# EAGLE schematic NSL_Proxmark4 (EAGLE 5.11)

## Sheet 1 of 2
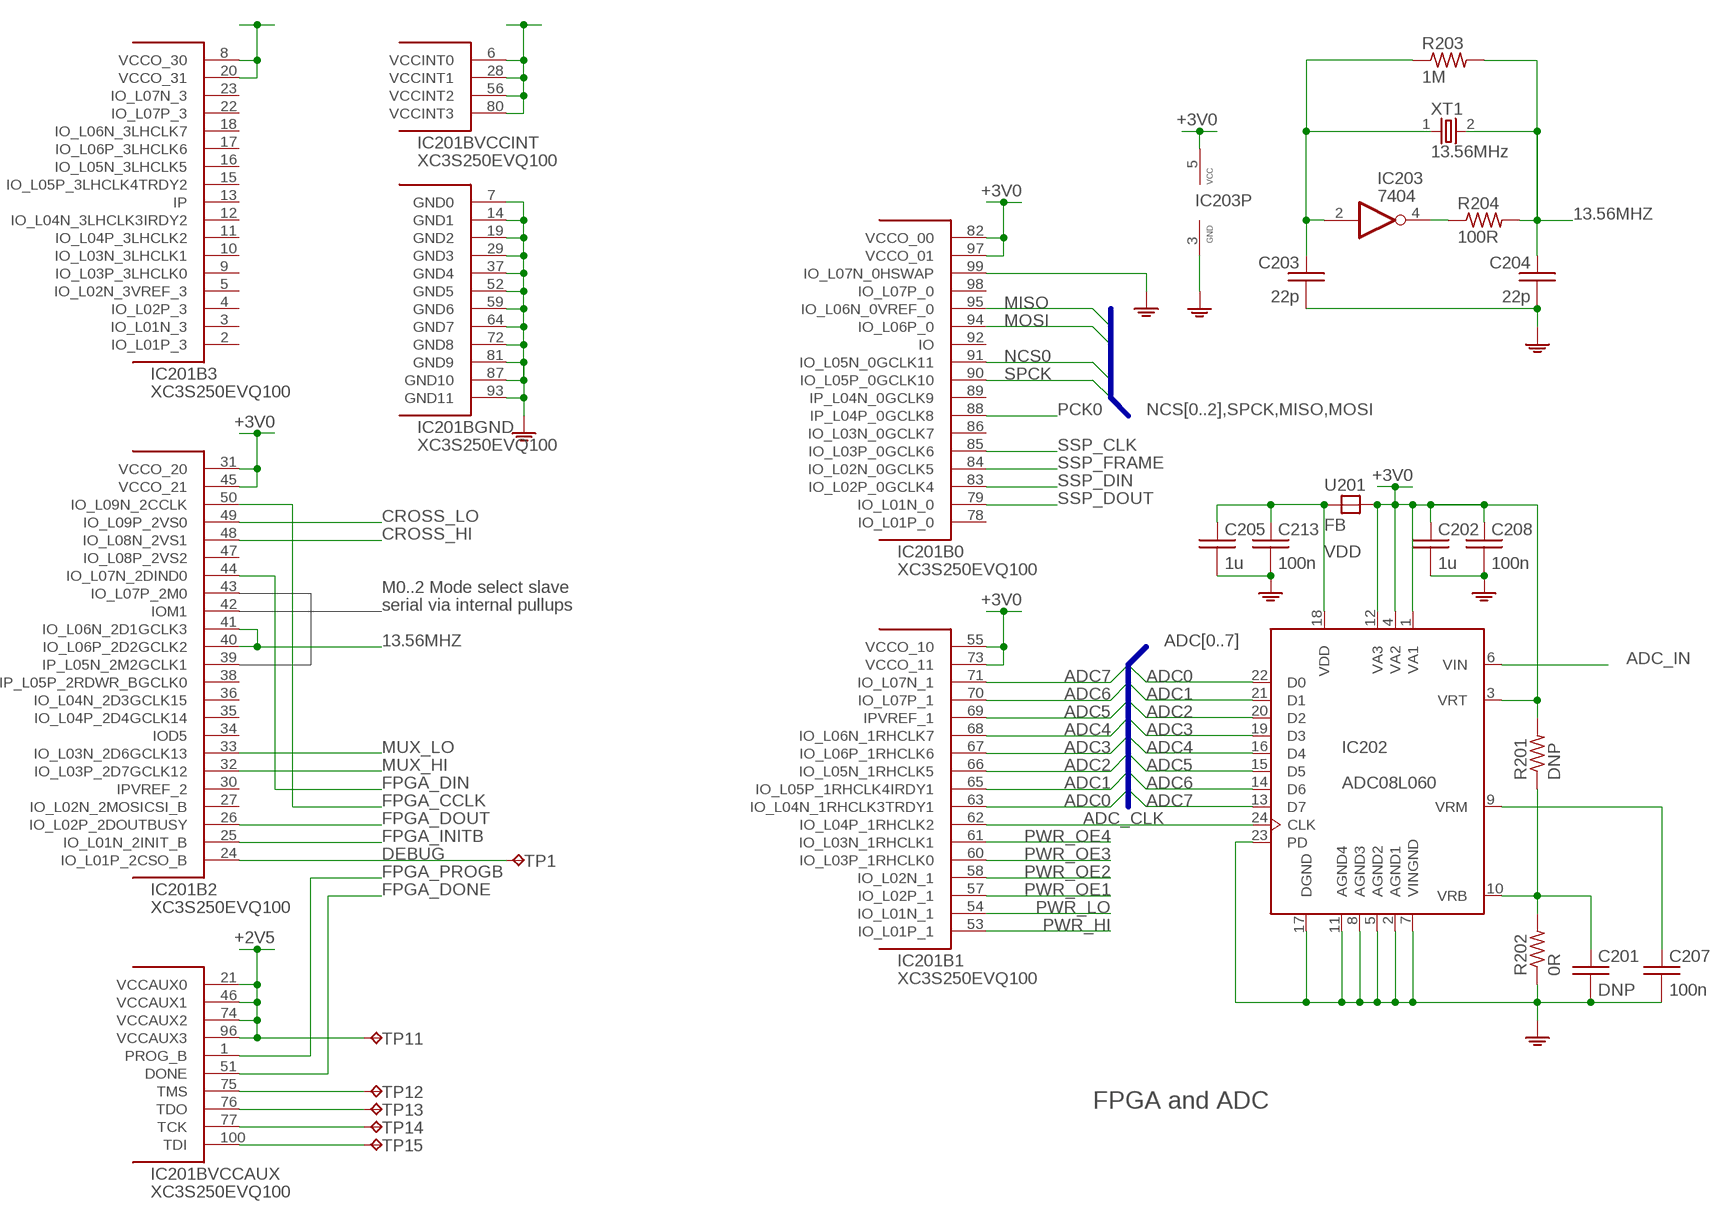
[diagram p0: schematic, sheet 1]

### Parts
C201  DNP  C-EU  [0603]
C202  1u  C-EU  [0603]
C203  22p  C-EU  [0603]
C204  22p  C-EU  [0603]
C205  1u  C-EU  [0603]
C207  100n  C-EU  [0603]
C208  100n  C-EU  [0603]
C213  100n  C-EU  [0603]
IC201  XC3S250EVQ100  [VQ100]
IC202  ADC08L060  ADC08060  [TSSOP24]
IC203  7404  [SOT-23-5]
R201  DNP  R-US  [0603]
R202  0R  R-US  [0603]
R203  1M  R-US  [0603]
R204  100R  R-US  [0603]
TP1  TPTP06SQ  [TP06SQ]
TP11  TPTP06SQ  [TP06SQ]
TP12  TPTP06SQ  [TP06SQ]
TP13  TPTP06SQ  [TP06SQ]
TP14  TPTP06SQ  [TP06SQ]
TP15  TPTP06SQ  [TP06SQ]
U201  FB  [0805]
XT1  13.56MHz  XTAL  [6035]

### Nets
13.56MHZ: C204.1 IC201.40(B2:IO_L06P_2D2GCLK2) IC201.41(B2:IO_L06N_2D1GCLK3) R203.2 R204.2 XT1.2(G$2)
+1V2: IC201.6(BVCCINT:VCCINT0) IC201.28(BVCCINT:VCCINT1) IC201.56(BVCCINT:VCCINT2) IC201.80(BVCCINT:VCCINT3)
+2V5: IC201.21(BVCCAUX:VCCAUX0) IC201.46(BVCCAUX:VCCAUX1) IC201.74(BVCCAUX:VCCAUX2) IC201.96(BVCCAUX:VCCAUX3) TP11.TP
+3V0: C202.1 C208.1 IC201.8(B3:VCCO_30) IC201.20(B3:VCCO_31) IC201.31(B2:VCCO_20) IC201.45(B2:VCCO_21) IC201.55(B1:VCCO_10) IC201.73(B1:VCCO_11) IC201.82(B0:VCCO_00) IC201.97(B0:VCCO_01) IC202.1(VA1) IC202.3(VRT) IC202.4(VA2) IC202.12(VA3) IC203.5(VCC) R201.2 U201.2(B) ; also sheet 2
ADC0: IC201.63(B1:IO_L04N_1RHCLK3TRDY1) IC202.22(D0)
ADC1: IC201.65(B1:IO_L05P_1RHCLK4IRDY1) IC202.21(D1)
ADC2: IC201.66(B1:IO_L05N_1RHCLK5) IC202.20(D2)
ADC3: IC201.67(B1:IO_L06P_1RHCLK6) IC202.19(D3)
ADC4: IC201.68(B1:IO_L06N_1RHCLK7) IC202.16(D4)
ADC5: IC201.69(B1:IPVREF_1) IC202.15(D5)
ADC6: IC201.70(B1:IO_L07P_1) IC202.14(D6)
ADC7: IC201.71(B1:IO_L07N_1) IC202.13(D7)
ADC_CLK: IC201.62(B1:IO_L04P_1RHCLK2) IC202.24(CLK)
ADC_IN: IC202.6(VIN) ; also sheet 2
CROSS_HI: IC201.48(B2:IO_L08N_2VS1) ; also sheet 2
CROSS_LO: IC201.49(B2:IO_L09P_2VS0) ; also sheet 2
DEBUG: IC201.24(B2:IO_L01P_2CSO_B) TP1.TP
FPGA_CCLK: IC201.50(B2:IO_L09N_2CCLK)
FPGA_DIN: IC201.44(B2:IO_L07N_2DIND0)
FPGA_DONE: IC201.51(BVCCAUX:DONE)
FPGA_DOUT: IC201.26(B2:IO_L02P_2DOUTBUSY)
FPGA_INITB: IC201.25(B2:IO_L01N_2INIT_B)
FPGA_PROGB: IC201.1(BVCCAUX:PROG_B)
FPGA_TCK: IC201.77(BVCCAUX:TCK) TP14.TP
FPGA_TDI: IC201.100(BVCCAUX:TDI) TP15.TP
FPGA_TDO: IC201.76(BVCCAUX:TDO) TP13.TP
FPGA_TMS: IC201.75(BVCCAUX:TMS) TP12.TP
GND: C201.2 C202.2 C203.2 C204.2 C205.2 C207.2 C208.2 C213.2 IC201.7(BGND:GND0) IC201.14(BGND:GND1) IC201.19(BGND:GND2) IC201.29(BGND:GND3) IC201.37(BGND:GND4) IC201.52(BGND:GND5) IC201.59(BGND:GND6) IC201.64(BGND:GND7) IC201.72(BGND:GND8) IC201.81(BGND:GND9) IC201.87(BGND:GND10) IC201.93(BGND:GND11) IC201.99(B0:IO_L07N_0HSWAP) IC202.2(AGND1) IC202.5(AGND2) IC202.7(VINGND) IC202.8(AGND3) IC202.11(AGND4) IC202.17(DGND) IC202.23(PD) IC203.3(GND) R202.1 ; supply symbol labelled AGND ; also sheet 2
MISO: IC201.95(B0:IO_L06N_0VREF_0)
MOSI: IC201.94(B0:IO_L06P_0)
MUX_HI: IC201.32(B2:IO_L03P_2D7GCLK12) ; also sheet 2
MUX_LO: IC201.33(B2:IO_L03N_2D6GCLK13) ; also sheet 2
N$1: C207.1 IC202.9(VRM)
N$3: IC203.4(O) R204.1
N$4: C203.1 IC203.2(I) R203.1 XT1.1(G$1)
N$9: C201.1 IC202.10(VRB) R201.1 R202.2
NCS0: IC201.91(B0:IO_L05N_0GCLK11)
PCK0: IC201.88(B0:IP_L04P_0GCLK8)
PWR_HI: IC201.53(B1:IO_L01P_1)
PWR_LO: IC201.54(B1:IO_L01N_1)
PWR_OE1: IC201.57(B1:IO_L02P_1)
PWR_OE2: IC201.58(B1:IO_L02N_1)
PWR_OE3: IC201.60(B1:IO_L03P_1RHCLK0)
PWR_OE4: IC201.61(B1:IO_L03N_1RHCLK1)
SPCK: IC201.90(B0:IO_L05P_0GCLK10)
SSP_CLK: IC201.85(B0:IO_L03P_0GCLK6)
SSP_DIN: IC201.83(B0:IO_L02P_0GCLK4)
SSP_DOUT: IC201.79(B0:IO_L01N_0)
SSP_FRAME: IC201.84(B0:IO_L02N_0GCLK5)
VDD: C205.1 C213.1 IC202.18(VDD) U201.1(A)
Unconnected: IC201.2(B3:IO_L01P_3) IC201.3(B3:IO_L01N_3) IC201.4(B3:IO_L02P_3) IC201.5(B3:IO_L02N_3VREF_3) IC201.9(B3:IO_L03P_3LHCLK0) IC201.10(B3:IO_L03N_3LHCLK1) IC201.11(B3:IO_L04P_3LHCLK2) IC201.12(B3:IO_L04N_3LHCLK3IRDY2) IC201.13(B3:IP) IC201.15(B3:IO_L05P_3LHCLK4TRDY2) IC201.16(B3:IO_L05N_3LHCLK5) IC201.17(B3:IO_L06P_3LHCLK6) IC201.18(B3:IO_L06N_3LHCLK7) IC201.22(B3:IO_L07P_3) IC201.23(B3:IO_L07N_3) IC201.27(B2:IO_L02N_2MOSICSI_B) IC201.30(B2:IPVREF_2) IC201.34(B2:IOD5) IC201.35(B2:IO_L04P_2D4GCLK14) IC201.36(B2:IO_L04N_2D3GCLK15) IC201.38(B2:IP_L05P_2RDWR_BGCLK0) IC201.39(B2:IP_L05N_2M2GCLK1) IC201.42(B2:IOM1) IC201.43(B2:IO_L07P_2M0) IC201.47(B2:IO_L08P_2VS2) IC201.78(B0:IO_L01P_0) IC201.86(B0:IO_L03N_0GCLK7) IC201.89(B0:IP_L04N_0GCLK9) IC201.92(B0:IO) IC201.98(B0:IO_L07P_0)

### Buses
NCS[0..2],SPCK,MISO,MOSI
ADC[0..7]

### Notes on the sheet
- M0..2 Mode select slave
- serial via internal pullups
- FPGA and ADC

## Sheet 2 of 2
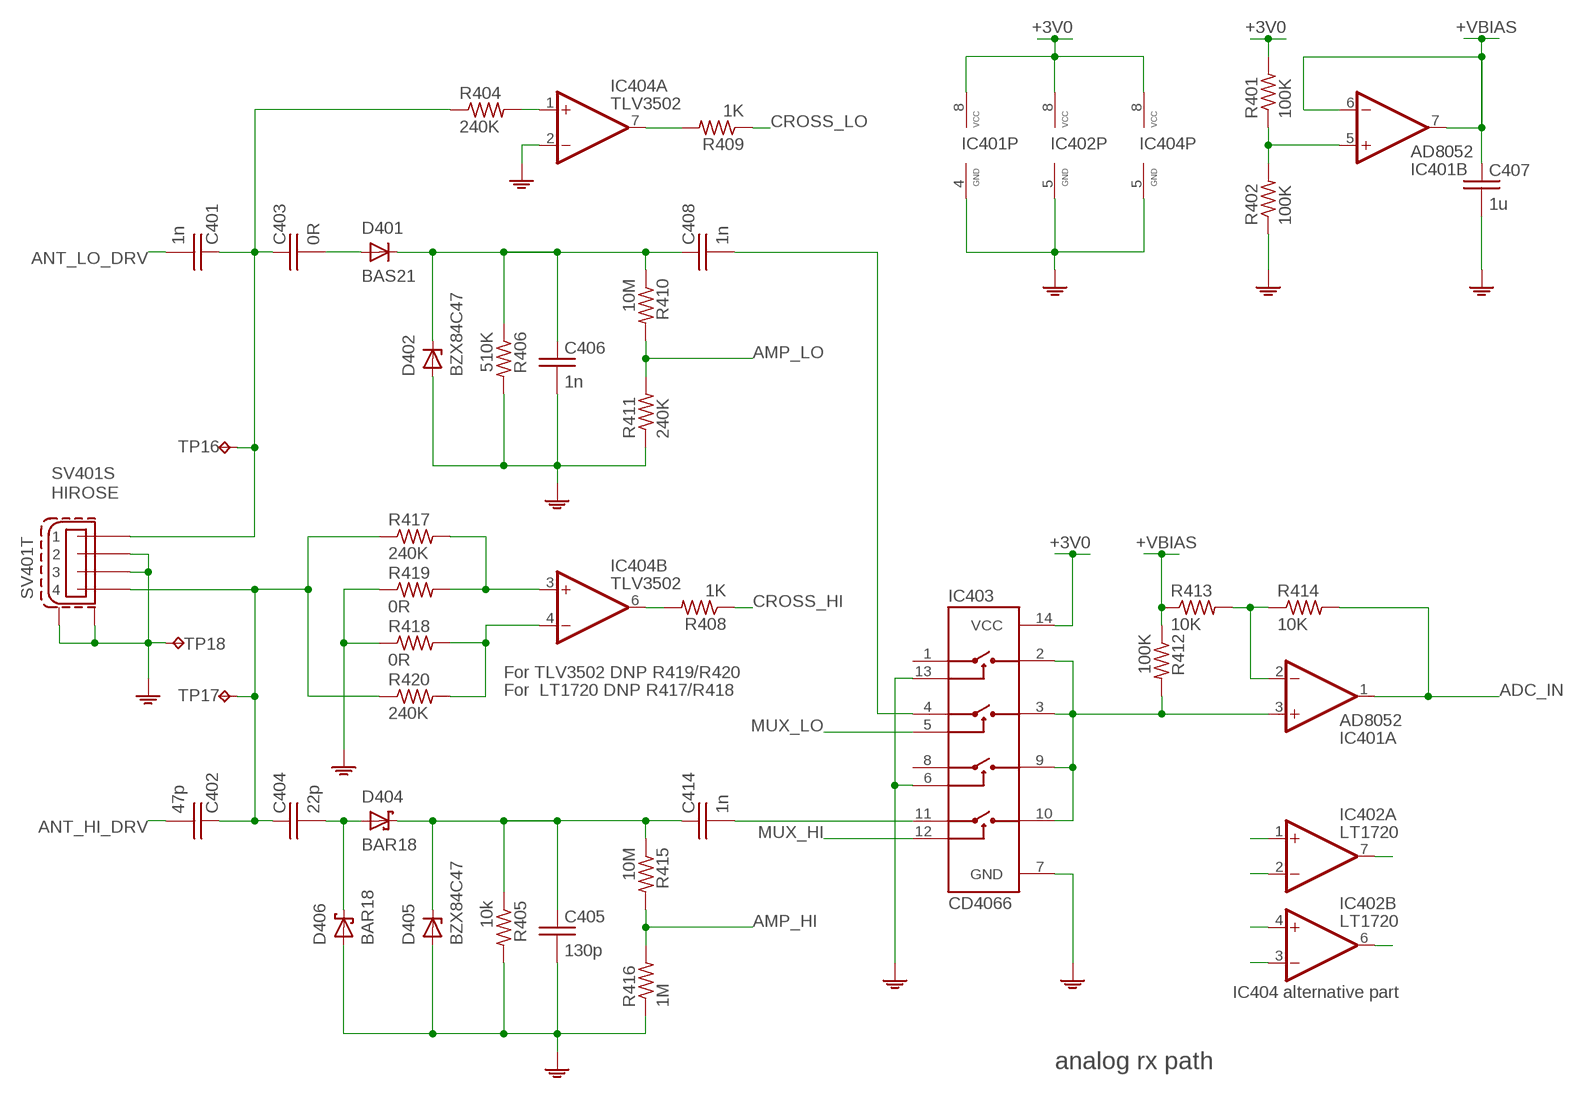
[diagram p1: schematic, sheet 2]

### Parts
C401  1n  C-EU  [0603]
C402  47p  C-EU  [0603]
C403  0R  C-EU  [0603]
C404  22p  C-EU  [0603]
C405  130p  C-EU  [0603]
C406  1n  C-EU  [0603]
C407  1u  C-EU  [0603]
C408  1n  C-EU  [0603]
C414  1n  C-EU  [0603]
D401  BAS21  [SOT-23-3]
D402  BZX84C47  [SOT-23-3]
D404  BAR18  [SOT-23-3]
D405  BZX84C47  [SOT-23-3]
D406  BAR18  [SOT-23-3]
IC401  AD8052  [MSOP8]
IC402  LT1720  [SOIC8]
IC403  CD4066  [TSSOP14]
IC404  TLV3502  TLV3502SOT23-8  [SOT-23-8]
R401  100K  R-US  [0603]
R402  100K  R-US  [0603]
R404  240K  R-US  [0603]
R405  10k  R-US  [0603]
R406  510K  R-US  [0603]
R408  1K  R-US  [0603]
R409  1K  R-US  [0603]
R410  10M  R-US  [0603]
R411  240K  R-US  [0603]
R412  100K  R-US  [0603]
R413  10K  R-US  [0603]
R414  10K  R-US  [0603]
R415  10M  R-US  [0603]
R416  1M  R-US  [0603]
R417  240K  R-US  [0603]
R418  0R  R-US  [0603]
R419  0R  R-US  [0603]
R420  240K  R-US  [0603]
SV401  HIROSE  HIROSE-MQ172  [HIROSE-MQ172]
TP16  TPTP06SQ  [TP06SQ]
TP17  TPTP06SQ  [TP06SQ]
TP18  TPTP06SQ  [TP06SQ]

### Nets
+3V0: IC401.8(P:VCC) IC402.8(P:VCC) IC403.14(VCC) IC404.8(P:VCC) R401.2 ; also sheet 1
+VBIAS: C407.1 IC401.6(B:-IN) IC401.7(B:OUT) R412.1 R413.1
ADC_IN: IC401.1(A:OUT) R414.2 ; also sheet 1
ADCDR_HI: C405.1 C414.1 D404.3(C) D405.3(C) R405.1 R415.1
ADCDR_LO: C406.1 C408.1 D401.3(C) D402.3(C) R406.1 R410.1
AMP_HI: R415.2 R416.2
AMP_LO: R410.2 R411.2
ANT_HI_DRV: C402.2
ANT_LO_DRV: C401.2
CROSS_HI: R408.1 ; also sheet 1
CROSS_LO: R409.1 ; also sheet 1
GND: C405.2 C406.2 C407.2 D402.1(A) D405.1(A) D406.1(A) IC401.4(P:GND) IC402.2(A:-IN) IC402.5(P:GND) IC403.6(C3) IC403.7(GND) IC403.13(C1) IC404.2(A:-IN) IC404.5(P:GND) R402.1 R405.2 R406.2 R411.1 R416.1 R418.1 R419.1 SV401.2 SV401.3 SV401.M1(T:S1) SV401.M2(T:S2) TP18.TP ; supply symbol labelled AGND ; also sheet 1
MUX_HI: IC403.12(C4) ; also sheet 1
MUX_LO: IC403.5(C2) ; also sheet 1
N$14: IC401.5(B:+IN) R401.1 R402.2
N$16: C414.2 IC403.11(A4)
N$17: C401.1 C403.1 R404.1 SV401.1 TP16.TP
N$20: C404.2 D404.1(A) D406.3(C)
N$23: IC402.1(A:+IN) IC404.1(A:+IN) R404.2
N$24: IC402.7(A:OUT) IC404.7(A:OUT) R409.2
N$25: IC401.3(A:+IN) IC403.2(B1) IC403.3(B2) IC403.9(B3) IC403.10(B4) R412.2
N$28: IC402.6(B:OUT) IC404.6(B:OUT) R408.2
N$29: IC402.3(B:-IN) IC404.3(B:+IN) R417.2 R419.2
N$30: C403.2 D401.1(A)
N$32: C408.2 IC403.4(A2)
N$40: IC402.4(B:+IN) IC404.4(B:-IN) R418.2 R420.2
N$43: C402.1 C404.1 R417.1 R420.1 SV401.4 TP17.TP
N$52: IC401.2(A:-IN) R413.2 R414.1
Unconnected: IC403.1(A1) IC403.8(A3)

### Notes on the sheet
- For TLV3502 DNP R419/R420
- For  LT1720 DNP R417/R418
- IC404 alternative part
- analog rx path

## Library data of the parts
C201-C205 C207 C208 C213 C401-C408 C414 = proxmark:C-EU: CERAMIC CHIP CAPACITOR
D401 = proxmark:BAS21: BAS21 fast switching diode Digikey part: BAS21INCT-ND
D402 D405 = proxmark:BZX84C*: ZENNER CHIP DIODE Digikey part: BZX84C47LT1GOSCT-ND
D404 D406 = proxmark:BAR18: SMALL SIGNAL SCHOTTKY DIODE Digikey part: 497-2529-1-ND
IC201 = proxmark:XC3S*EVQ100: Xilinx FPGA
IC202 = proxmark:ADC08060: 8BIT A/D CONVERTER, 60MHZ Digikey part: ADC08060CIMTXCT-ND
IC203 = proxmark:74*04: Single CMOS inverter gate Digikey part: TC7SU04FFCT-ND
IC401 = proxmark:AD8052: Rail-to-rail Op-Amp Digikey part: AD8052ARMZ-ND
IC402 = proxmark:LT1720
IC403 = proxmark:CD4066: 4-CH MUX 1.8/5.5V Digikey part: 296-14123-1-ND
IC404 = proxmark:TLV3502
R201-R204 R401 R402 R404-R406 R408-R420 = proxmark:R-US: CHIP RESISTOR
SV401 = proxmark:HIROSE-MQ172: HIROSE MQ172 Connector Digikey part: H10488-ND
TP1 TP11-TP18 = proxmark:TP: Test pad
U201 = proxmark:FB: FERRITE BEAD
XT1 = proxmark:XTAL: CRYSTAL Citizen CS10 series 6.0mm x 3.5mm package